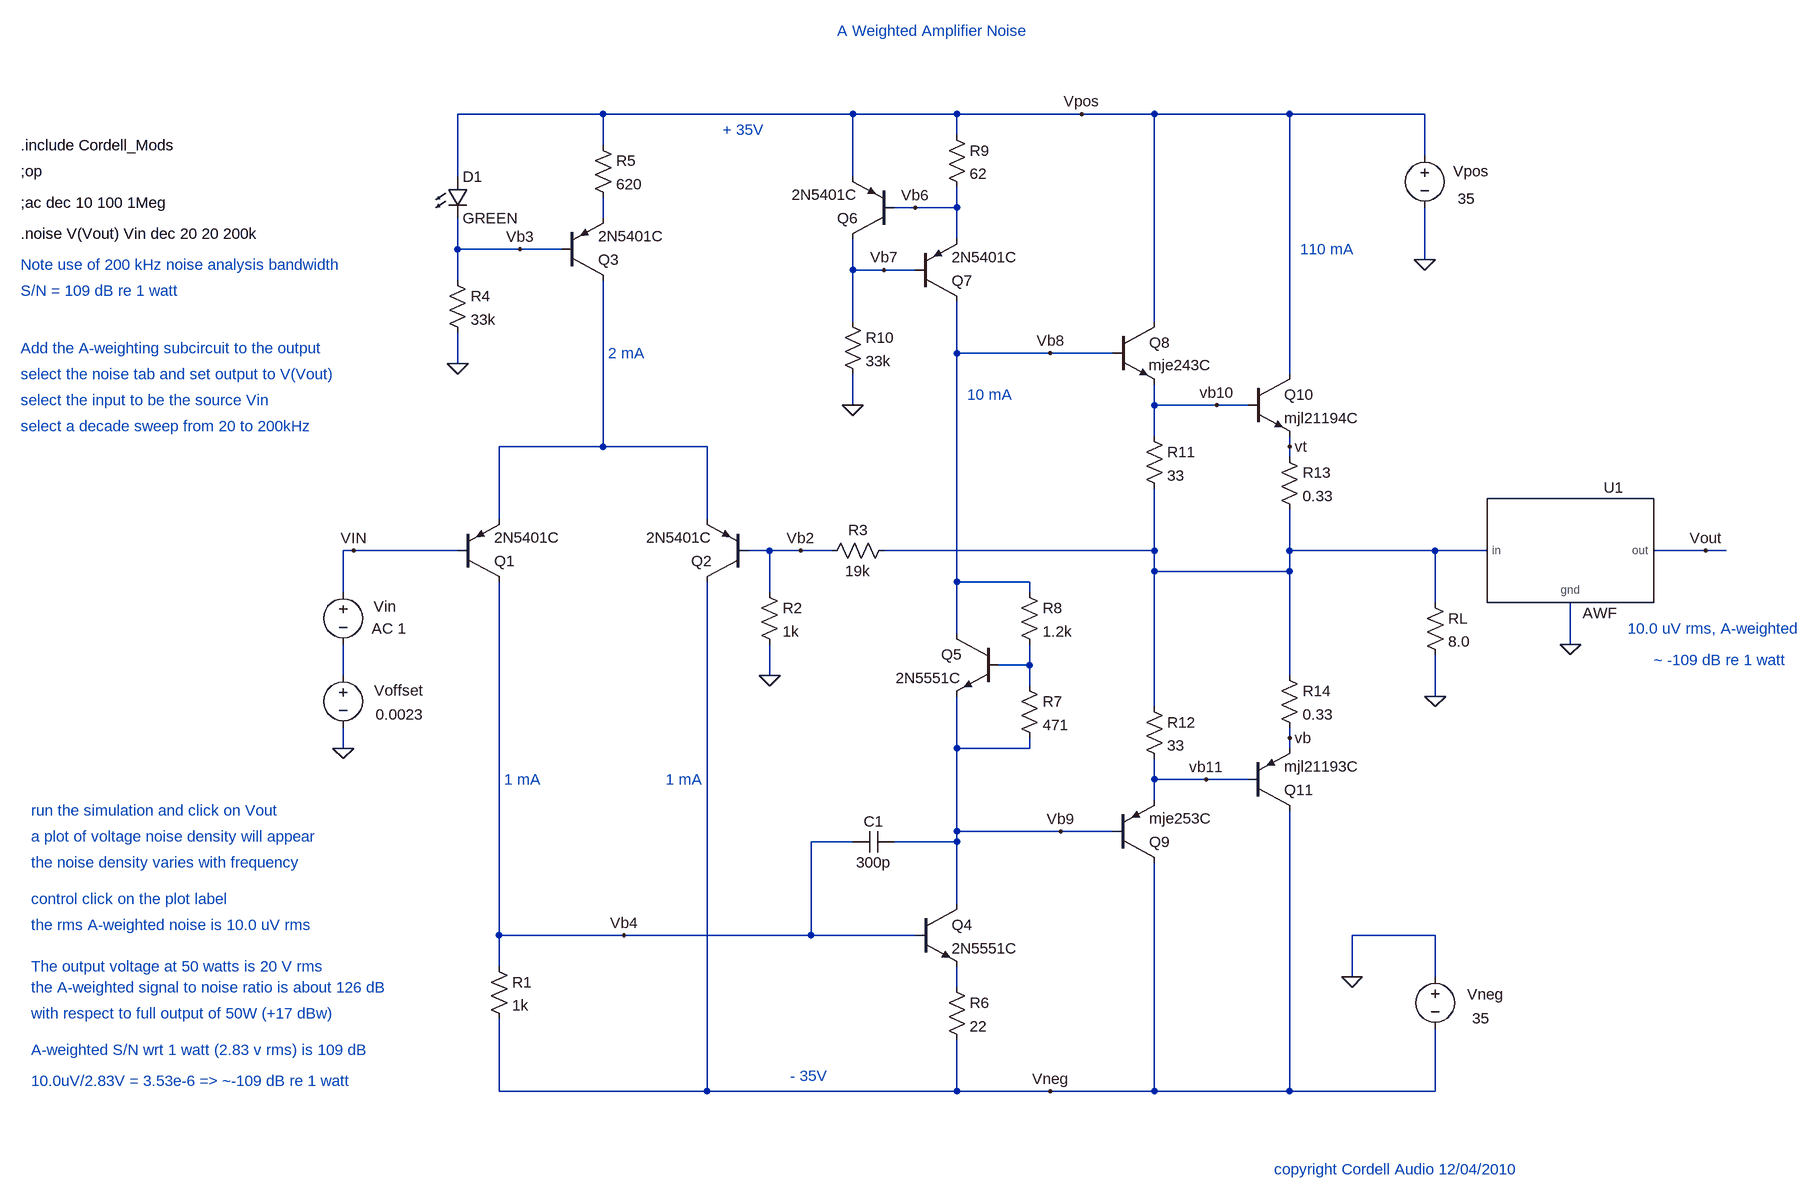
[diagram p0: schematic Amplifier A Noise.asc]
Amplifier A Noise.asc, the LTspice schematic file:
Version 4
SHEET 1 2428 1420
WIRE -128 -224 -352 -224
WIRE 256 -224 -128 -224
WIRE 416 -224 256 -224
WIRE 608 -224 416 -224
WIRE 720 -224 608 -224
WIRE 928 -224 720 -224
WIRE 1136 -224 928 -224
WIRE 416 -192 416 -224
WIRE -128 -176 -128 -224
WIRE 1136 -160 1136 -224
WIRE -352 -128 -352 -224
WIRE 256 -128 256 -224
WIRE 352 -80 320 -80
WIRE 416 -80 416 -112
WIRE 416 -80 352 -80
WIRE -128 -64 -128 -96
WIRE 416 -32 416 -80
WIRE -352 -16 -352 -64
WIRE -256 -16 -352 -16
WIRE -192 -16 -256 -16
WIRE 1136 0 1136 -80
WIRE 256 16 256 -32
WIRE 304 16 256 16
WIRE 352 16 304 16
WIRE -352 32 -352 -16
WIRE 256 96 256 16
WIRE 720 96 720 -224
WIRE 416 144 416 64
WIRE 560 144 416 144
WIRE 656 144 560 144
WIRE -352 160 -352 112
WIRE 928 176 928 -224
WIRE 256 224 256 176
WIRE 720 224 720 192
WIRE 816 224 720 224
WIRE 864 224 816 224
WIRE 720 272 720 224
WIRE -128 288 -128 32
WIRE -128 288 -288 288
WIRE 32 288 -128 288
WIRE 928 288 928 272
WIRE 928 304 928 288
WIRE -288 400 -288 288
WIRE 32 400 32 288
WIRE -512 448 -528 448
WIRE -352 448 -512 448
WIRE 128 448 96 448
WIRE 176 448 128 448
WIRE 224 448 176 448
WIRE 720 448 720 352
WIRE 720 448 304 448
WIRE 928 448 928 384
WIRE 1152 448 928 448
WIRE 1232 448 1152 448
WIRE 1568 448 1488 448
WIRE 1600 448 1568 448
WIRE 720 480 720 448
WIRE 928 480 928 448
WIRE 928 480 720 480
WIRE 416 496 416 144
WIRE 528 496 416 496
WIRE -528 512 -528 448
WIRE 128 512 128 448
WIRE 528 512 528 496
WIRE 1152 528 1152 448
WIRE 416 576 416 496
WIRE 1360 592 1360 528
WIRE 528 624 528 592
WIRE 528 624 480 624
WIRE -528 640 -528 592
WIRE 128 640 128 592
WIRE 928 640 928 480
WIRE 528 656 528 624
WIRE 1152 672 1152 608
WIRE 720 688 720 480
WIRE 928 736 928 720
WIRE -528 752 -528 720
WIRE 416 752 416 672
WIRE 528 752 528 736
WIRE 528 752 416 752
WIRE 928 752 928 736
WIRE 720 800 720 768
WIRE 800 800 720 800
WIRE 864 800 800 800
WIRE 720 832 720 800
WIRE 416 880 416 752
WIRE 576 880 416 880
WIRE 656 880 576 880
WIRE 256 896 192 896
WIRE 416 896 416 880
WIRE 416 896 320 896
WIRE 416 992 416 896
WIRE -288 1040 -288 496
WIRE -96 1040 -288 1040
WIRE 192 1040 192 896
WIRE 192 1040 -96 1040
WIRE 352 1040 192 1040
WIRE 1152 1040 1024 1040
WIRE -288 1088 -288 1040
WIRE 1024 1104 1024 1040
WIRE 1152 1104 1152 1040
WIRE 416 1120 416 1088
WIRE -288 1280 -288 1168
WIRE 32 1280 32 496
WIRE 32 1280 -288 1280
WIRE 416 1280 416 1200
WIRE 416 1280 32 1280
WIRE 560 1280 416 1280
WIRE 720 1280 720 928
WIRE 720 1280 560 1280
WIRE 928 1280 928 848
WIRE 928 1280 720 1280
WIRE 1152 1280 1152 1184
WIRE 1152 1280 928 1280
FLAG -528 752 0
FLAG -512 448 VIN
FLAG -352 160 0
FLAG 128 640 0
FLAG 1024 1104 0
FLAG 1136 0 0
FLAG 928 288 vt
FLAG 928 736 vb
FLAG 816 224 vb10
FLAG 800 800 vb11
FLAG 256 224 0
FLAG 1152 672 0
FLAG 560 144 Vb8
FLAG 576 880 Vb9
FLAG 176 448 Vb2
FLAG -256 -16 Vb3
FLAG -96 1040 Vb4
FLAG 352 -80 Vb6
FLAG 304 16 Vb7
FLAG 1568 448 Vout
FLAG 608 -224 Vpos
FLAG 560 1280 Vneg
FLAG 1360 592 0
SYMBOL pnp -192 32 M180
SYMATTR InstName Q3
SYMATTR Value 2N5401C
SYMBOL pnp 320 -32 R180
SYMATTR InstName Q6
SYMATTR Value 2N5401C
SYMBOL voltage -528 496 R0
WINDOW 123 44 72 Left 0
WINDOW 39 0 0 Left 0
WINDOW 3 -98 -98 Left 0
WINDOW 0 47 38 Left 0
SYMATTR Value2 AC 1
SYMATTR Value ""
SYMATTR InstName Vin
SYMBOL cap 320 880 R90
WINDOW 0 0 32 VBottom 0
WINDOW 3 32 32 VTop 0
SYMATTR InstName C1
SYMATTR Value 300p
SYMBOL npn 352 992 R0
SYMATTR InstName Q4
SYMATTR Value 2N5551C
SYMBOL res 400 -208 R0
SYMATTR InstName R9
SYMATTR Value 62
SYMBOL pnp 352 64 M180
SYMATTR InstName Q7
SYMATTR Value 2N5401C
SYMBOL res 400 1104 R0
SYMATTR InstName R6
SYMATTR Value 22
SYMBOL res -304 1072 R0
SYMATTR InstName R1
SYMATTR Value 1k
SYMBOL pnp -352 496 M180
SYMATTR InstName Q1
SYMATTR Value 2N5401C
SYMBOL pnp 96 496 R180
SYMATTR InstName Q2
SYMATTR Value 2N5401C
SYMBOL res -144 -192 R0
SYMATTR InstName R5
SYMATTR Value 620
SYMBOL res -368 16 R0
SYMATTR InstName R4
SYMATTR Value 33k
SYMBOL voltage 1136 -176 R0
WINDOW 123 0 0 Left 0
WINDOW 39 0 0 Left 0
WINDOW 0 44 40 Left 0
WINDOW 3 51 82 Left 0
SYMATTR InstName Vpos
SYMATTR Value 35
SYMBOL res 320 432 R90
WINDOW 0 0 56 VBottom 0
WINDOW 3 32 56 VTop 0
SYMATTR InstName R3
SYMATTR Value 19k
SYMBOL voltage 1152 1088 R0
WINDOW 123 0 0 Left 0
WINDOW 39 0 0 Left 0
WINDOW 0 49 43 Left 0
WINDOW 3 57 80 Left 0
SYMATTR InstName Vneg
SYMATTR Value 35
SYMBOL res 112 496 R0
SYMATTR InstName R2
SYMATTR Value 1k
SYMBOL npn 656 96 R0
WINDOW 3 55 66 Left 0
SYMATTR Value mje243C
SYMATTR InstName Q8
SYMBOL pnp 656 928 M180
SYMATTR InstName Q9
SYMATTR Value mje253C
SYMBOL res 912 624 R0
SYMATTR InstName R14
SYMATTR Value 0.33
SYMBOL res 912 288 R0
SYMATTR InstName R13
SYMATTR Value 0.33
SYMBOL npn 864 176 R0
SYMATTR InstName Q10
SYMATTR Value mjl21194C
SYMBOL pnp 864 848 M180
SYMATTR InstName Q11
SYMATTR Value mjl21193C
SYMBOL res 704 672 R0
SYMATTR InstName R12
SYMATTR Value 33
SYMBOL LED -368 -128 R0
SYMATTR InstName D1
SYMATTR Value GREEN
SYMBOL res 240 80 R0
SYMATTR InstName R10
SYMATTR Value 33k
SYMBOL res 1136 512 R0
SYMATTR InstName RL
SYMATTR Value 8.0
SYMBOL res 704 256 R0
SYMATTR InstName R11
SYMATTR Value 33
SYMBOL voltage -528 624 R0
WINDOW 123 0 0 Left 0
WINDOW 39 0 0 Left 0
WINDOW 0 48 39 Left 0
WINDOW 3 50 76 Left 0
SYMATTR InstName Voffset
SYMATTR Value 0.0023
SYMBOL npn 480 576 M0
SYMATTR InstName Q5
SYMATTR Value 2N5551C
SYMBOL res 512 496 R0
SYMATTR InstName R8
SYMATTR Value 1.2k
SYMBOL res 512 640 R0
SYMATTR InstName R7
SYMATTR Value 471
SYMBOL AWF 1360 448 R0
SYMATTR InstName U1
TEXT -1024 -136 Left 0 !;op
TEXT -1024 -88 Left 0 !;ac dec 10 100 1Meg
TEXT -120 144 Left 0 ;2 mA
TEXT -280 800 Left 0 ;1 mA
TEXT 432 208 Left 0 ;10 mA
TEXT 56 -200 Left 0 ;+ 35V
TEXT 160 1256 Left 0 ;- 35V
TEXT -32 800 Left 0 ;1 mA
TEXT -1024 -40 Left 0 !.noise V(Vout) Vin dec 20 20 200k
TEXT 944 -16 Left 0 ;110 mA
TEXT -1024 176 Left 0 ;select the noise tab and set output to V(Vout)
TEXT -1024 216 Left 0 ;select the input to be the source Vin
TEXT -1024 256 Left 0 ;select a decade sweep from 20 to 200kHz
TEXT -1008 848 Left 0 ;run the simulation and click on Vout
TEXT -1008 888 Left 0 ;a plot of voltage noise density will appear
TEXT -1008 928 Left 0 ;the noise density varies with frequency
TEXT -1008 984 Left 0 ;control click on the plot label
TEXT -1008 1024 Left 0 ;the rms A-weighted noise is 10.0 uV rms
TEXT -1008 1088 Left 0 ;The output voltage at 50 watts is 20 V rms
TEXT -1008 1120 Left 0 ;the A-weighted signal to noise ratio is about 126 dB
TEXT -1024 8 Left 0 ;Note use of 200 kHz noise analysis bandwidth
TEXT 1448 568 Left 0 ;10.0 uV rms, A-weighted
TEXT -1008 1160 Left 0 ;with respect to full output of 50W (+17 dBw)
TEXT -1008 1216 Left 0 ;A-weighted S/N wrt 1 watt (2.83 v rms) is 109 dB
TEXT -1008 1264 Left 0 ;10.0uV/2.83V = 3.53e-6 => ~-109 dB re 1 watt
TEXT -1024 136 Left 0 ;Add the A-weighting subcircuit to the output
TEXT -1024 48 Left 0 ;S/N = 109 dB re 1 watt
TEXT 904 1400 Left 0 ;copyright Cordell Audio 12/04/2010
TEXT 232 -352 Left 0 ;A Weighted Amplifier Noise
TEXT -1024 -176 Left 0 !.include Cordell_Mods
TEXT 1488 616 Left 0 ;~ -109 dB re 1 watt

The netlist it stands for:
* Amplifier A Noise.asc
Q3 N002 Vb3 N001 0 2N5401C
Q6 Vb7 Vb6 Vpos 0 2N5401C
Vin VIN N005 AC 1
C1 Vb9 Vb4 300p
Q4 Vb9 Vb4 N006 0 2N5551C
R9 Vpos Vb6 62
Q7 Vb8 Vb7 Vb6 0 2N5401C
R6 N006 Vneg 22
R1 Vb4 Vneg 1k
Q1 Vb4 VIN N002 0 2N5401C
Q2 Vneg Vb2 N002 0 2N5401C
R5 Vpos N001 620
R4 Vb3 0 33k
Vpos Vpos 0 35
R3 N003 Vb2 19k
Vneg 0 Vneg 35
R2 Vb2 0 1k
Q8 Vpos Vb8 vb10 0 mje243C
Q9 Vneg Vb9 vb11 0 mje253C
R14 N003 vb 0.33
R13 vt N003 0.33
Q10 Vpos vb10 vt 0 mjl21194C
Q11 Vneg vb11 vb 0 mjl21193C
R12 N003 vb11 33
D1 Vpos Vb3 GREEN
R10 Vb7 0 33k
RL N003 0 8.0
R11 vb10 N003 33
Voffset N005 0 0.0023
Q5 Vb8 N004 Vb9 0 2N5551C
R8 Vb8 N004 1.2k
R7 N004 Vb9 471
XU1 N003 Vout 0 AWF  ; pins in out gnd
.model D D
.lib standard.dio
.model NPN NPN
.model PNP PNP
.lib standard.bjt
;op
;ac dec 10 100 1Meg
* 2 mA
* 1 mA
* 10 mA
* + 35V
* - 35V
* 1 mA
.noise V(Vout) Vin dec 20 20 200k
* 110 mA
* select the noise tab and set output to V(Vout)
* select the input to be the source Vin
* select a decade sweep from 20 to 200kHz
* run the simulation and click on Vout
* a plot of voltage noise density will appear
* the noise density varies with frequency
* control click on the plot label
* the rms A-weighted noise is 10.0 uV rms
* The output voltage at 50 watts is 20 V rms
* the A-weighted signal to noise ratio is about 126 dB
* Note use of 200 kHz noise analysis bandwidth
* 10.0 uV rms, A-weighted
* with respect to full output of 50W (+17 dBw)
* A-weighted S/N wrt 1 watt (2.83 v rms) is 109 dB
* 10.0uV/2.83V = 3.53e-6 => ~-109 dB re 1 watt
* Add the A-weighting subcircuit to the output
* S/N = 109 dB re 1 watt
* copyright Cordell Audio 12/04/2010
* A Weighted Amplifier Noise
.include Cordell_Mods
* ~ -109 dB re 1 watt
.lib AWF.sub
.backanno
.end